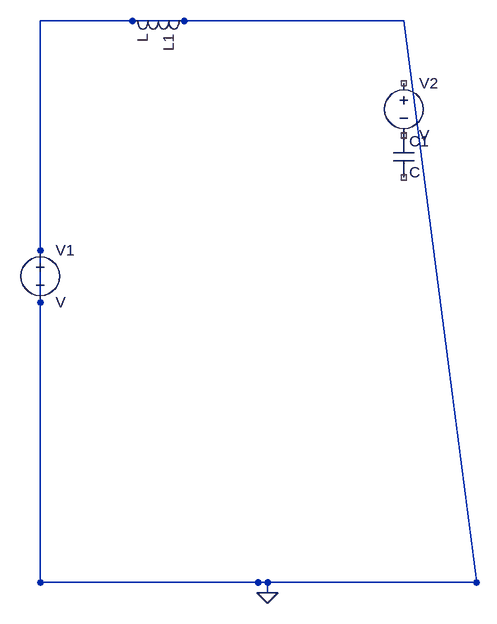
[diagram p0: schematic ltspice_final.asc]
ltspice_final.asc, the LTspice schematic file:
Version 4
SHEET 1 880 680
SYMBOL voltage 352 561 R0
SYMATTR InstName V1
SYMBOL voltage 912 304 R0
SYMATTR InstName V2
SYMBOL cap 896 401 R0
SYMATTR InstName C1
FLAG 702 1104 0
WIRE 702 1088 702 1104
SYMBOL ind 590 208 R90
SYMATTR InstName L1
WIRE 912 224 1024 1088
WIRE 352 1088 1024 1088
WIRE 688 1088 1024 1088
WIRE 352 224 912 224
WIRE 352 1088 688 1088
WIRE 352 224 352 1088

The netlist it stands for:
* ltspice_final.asc
V1 0 0 V
V2 NC_01 NC_02 V
C1 NC_03 NC_04 C
L1 0 0 L
.backanno
.end